# EAGLE design ovc3868-2 (EAGLE 6.5.0)
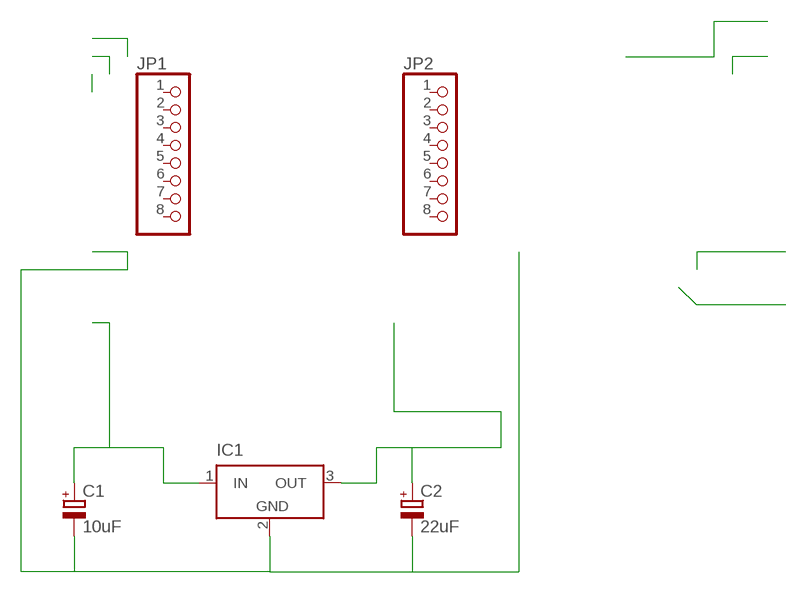
[diagram p0: schematic, sheet 1]

## Parts
C1  10uF  CPOL-EU140CLH-0810  [140CLH-0810]
C2  22uF  CPOL-EU140CLH-0810  [140CLH-0810]
IC1  LT1129CST5  [SOT223]
JP1  PINHD-1X8  [1X08]
JP2  PINHD-1X8  [1X08]

## Nets
N$1: C1.+ IC1.1(IN)
N$2: C1.- C2.- IC1.2(GND)
N$3: C2.+ IC1.3(OUT)
Unconnected: JP1.1 JP1.2 JP1.3 JP1.4 JP1.5 JP1.6 JP1.7 JP1.8 JP2.1 JP2.2 JP2.3 JP2.4 JP2.5 JP2.6 JP2.7 JP2.8

## Power pins joined to a net without a drawn wire
GND: IC1.4(GND)

## Library data of the parts
C1 C2 = rcl:CPOL-EU: POLARIZED CAPACITOR, European symbol
IC1 = linear-technology:LT1129CST5: VOLTAGE REGULATOR with shutdown; MPN: LT1129CST-5#PBF; OC_FARNELL: 1663375; OC_NEWARK: 57M2069
JP1 JP2 = pinhead:PINHD-1X8: PIN HEADER

## Board
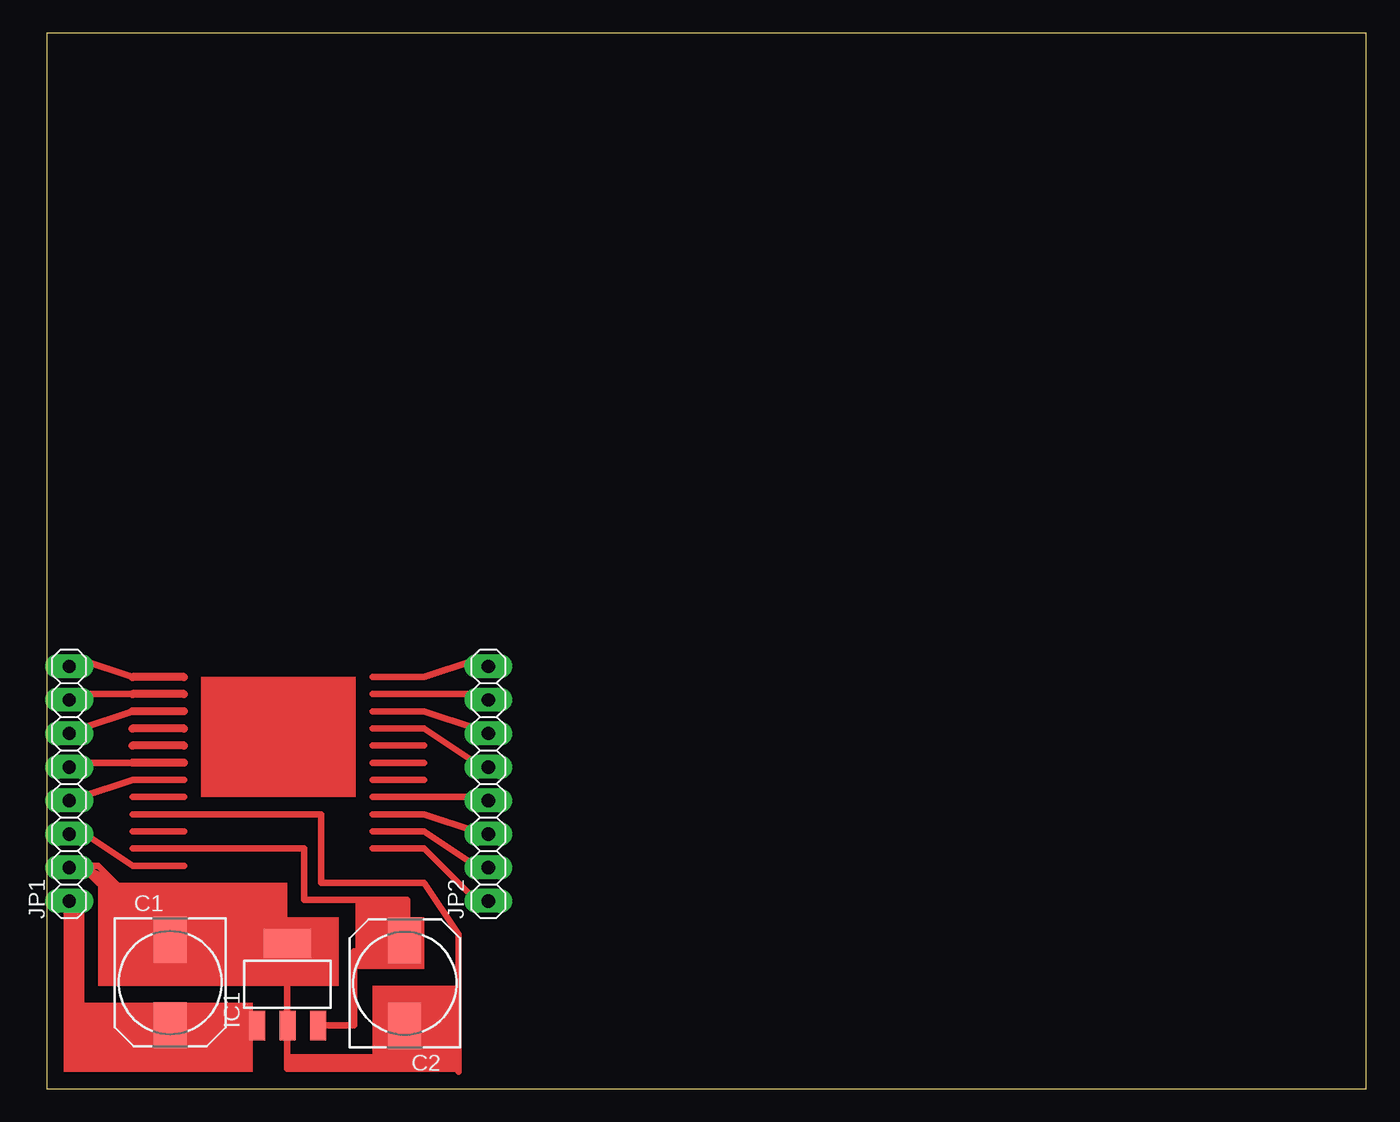
[diagram p1: board, top side]

Size 100 x 80 mm. Coordinates in mm from the lower left corner, seen from the top.
Outline: 0,0 100,0 100,80 0,80 0,0
Copper layers (1*16): Top 0.035mm / dielectric 1.5mm / Bottom 0.035mm
Design rules "default *": minimum track width 10mil, minimum drill 24mil, track to track 8mil, track to pad 8mil, pad to pad 8mil, via to via 8mil, smd to smd 8mil, copper to edge 40mil, drill to drill 8mil, minimum pad ring 16mil, minimum via ring 8mil, stop-mask expansion 4mil, vias tented up to drill 0mil, thermal gap 10mil

### Footprints (pad centres in the part's own frame; a part is rotated, then mirrored left to right if it is on the bottom)
140CLH-0810 = smd 3.5 x 2.5: + 3.25,0; - -3.25,0
SOT223 = smd 1.219 x 2.235: 1 -2.311,-3.099; 2 0,-3.099; 3 2.311,-3.099 | smd 3.6 x 2.2: 4 0,3.099
1X08 = drill 1.016 long: 1 -8.89,0; 2 -6.35,0; 3 -3.81,0; 4 -1.27,0; 5 1.27,0; 6 3.81,0; 7 6.35,0; 8 8.89,0

### Placement (x,y rotation side)
C1  9.35,8.05 270 top
C2  27.13,7.99 90 top
IC1  18.24,7.9 0 top
JP1  1.7,23.11 90 top
JP2  33.45,23.11 90 top

### Tracks (layer width: path | path; a pad name or v marks a point on that pad's centre or on a via)
N$1
  Top 0.5: IC1.1 C1.+
N$2
  Top 0.5: C1.- 9.35,11.68 18.21,11.68 18.21,4.8 | IC1.2 18.21,4.8 | 18.21,4.8 18.21,1.52 27.13,1.52 C2.-
N$3
  Top 0.5: IC1.3 23.29,4.8 23.29,10.41 27.13,10.41 C2.+
N$4
  Top 0.5: 10.4,23.4 6.5,23.4 2.6,22.1
N$5
  Top 0.5: 10.4,22.1 6.5,22.1
N$6
  Top 0.5: 6.5,20.8 20.8,20.8 20.8,15.6 28.6,15.6 31.2,11.7 31.2,1.3
N$7
  Top 0.5: 9.1,5.2 2.6,5.2 2.6,14.3
N$8
  Top 0.5: 2.6,16.9 3.9,16.9 5.2,15.6 | 5.2,15.6 6.5,14.3 2.6,16.9 | 3.9,15.6 2.6,16.9 | 5.2,15.6 2.6,16.9
N$9
  Top 0.5: 6.5,19.5 10.4,19.5
N$15
  Top 0.5: 6.5,31.2 2.6,32.5
  Top 0.61: 10.4,31.2 6.5,31.2
N$16
  Top 0.5: 6.5,29.9 2.6,29.9
  Top 0.61: 10.4,29.9 6.5,29.9
N$17
  Top 0.5: 6.5,28.6 2.6,27.3
  Top 0.61: 10.4,28.6 6.5,28.6
N$18
  Top 0.61: 10.4,27.3 6.5,27.3
N$19
  Top 0.61: 10.4,26 6.5,26
N$20
  Top 0.5: 6.5,24.7 2.6,24.7
  Top 0.61: 10.4,24.7 6.5,24.7
N$21
  Top 0.5: 6.5,18.2 19.5,18.2 19.5,14.3 27.3,14.3 27.3,11.7
N$22
  Top 0.5: 10.4,16.9 6.5,16.9 2.6,19.5
N$24
  Top 0.5: 24.7,18.2 28.6,18.2 32.5,14.3
N$25
  Top 0.5: 24.7,19.5 28.6,19.5 32.5,16.9
N$26
  Top 0.5: 24.7,20.8 28.6,20.8 32.5,19.5
N$27
  Top 0.5: 24.7,22.1 32.5,22.1
N$28
  Top 0.5: 24.7,23.4 28.6,23.4
N$29
  Top 0.5: 24.7,24.7 28.6,24.7
N$30
  Top 0.5: 24.7,26 28.6,26
N$31
  Top 0.5: 24.7,27.3 28.6,27.3 32.5,24.7
N$32
  Top 0.5: 24.7,28.6 28.6,28.6 32.5,27.3
N$33
  Top 0.5: 24.7,29.9 32.5,29.9
N$34
  Top 0.5: 24.7,31.2 28.6,31.2 32.5,32.5
(copper drawn outside any net)
  shapes: Top area x9